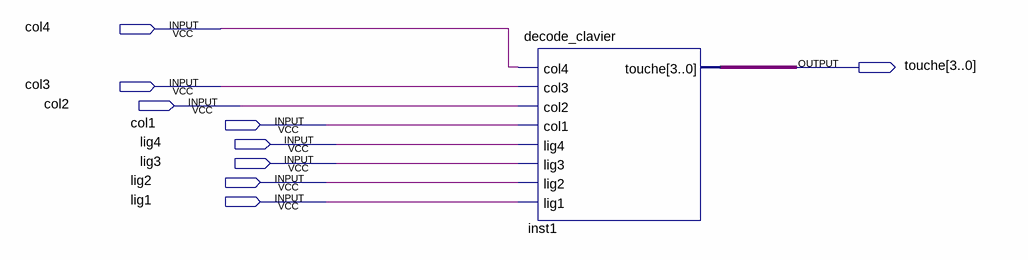
[diagram p0: schematic sheet]
// Quartus schematic decode_clavier.bdf as structural Verilog: 1 symbols, 9 pins
module decode_clavier (
  input  col4,
  input  col3,
  input  col2,
  input  col1,
  input  lig4,
  input  lig3,
  input  lig2,
  input  lig1,
  output [3:0] touche
);

  decode_clavier inst1 (
    .col4(col4), .col3(col3), .col2(col2), .col1(col1), .lig4(lig4), .lig3(lig3), .lig2(lig2), .lig1(lig1),
    .touche(touche));
endmodule
